# EAGLE design W023A (EAGLE 6.6.0)
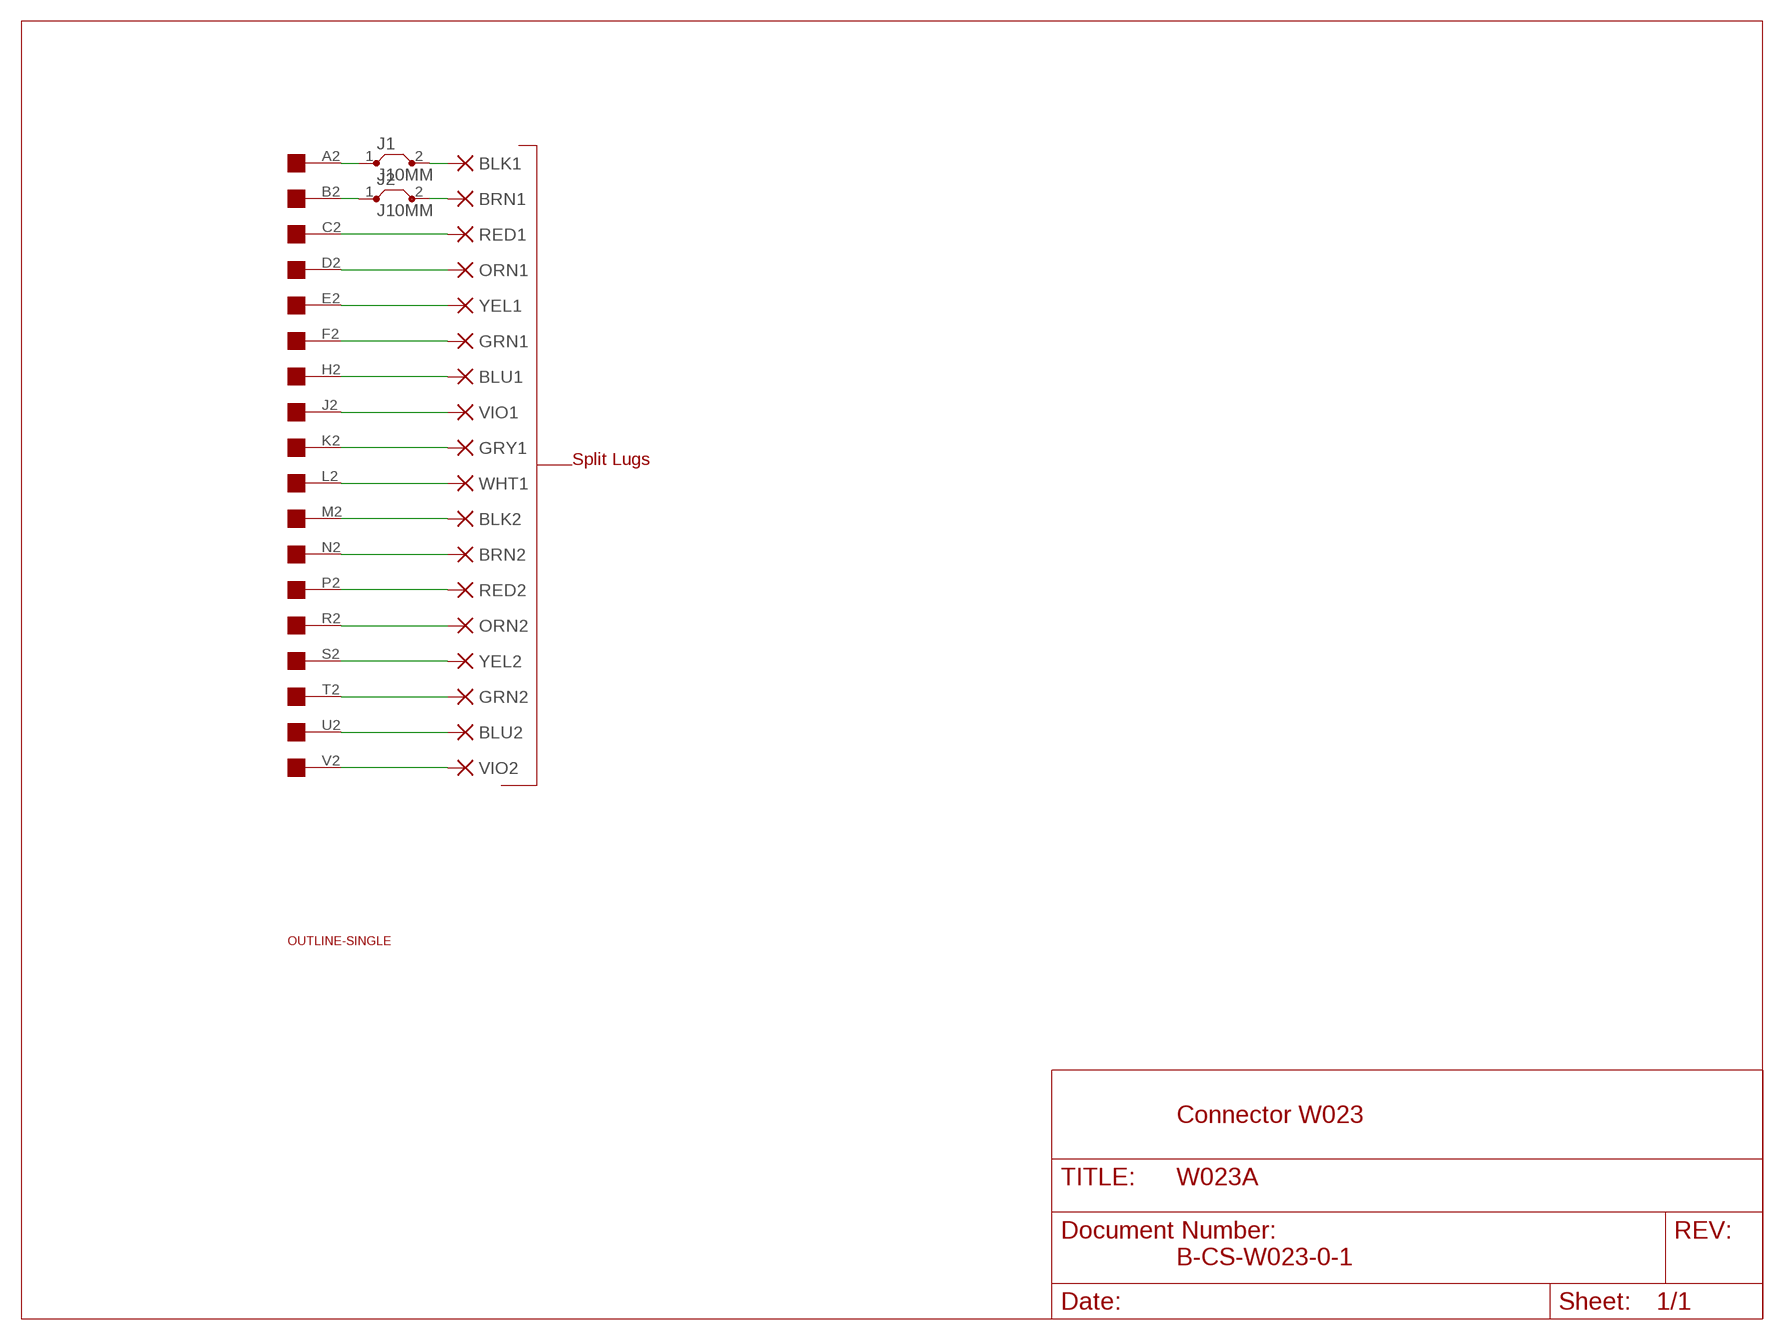
[diagram p0: schematic, sheet 1]

## Parts
BLK1  PAD-0465  [0465]
BLK2  PAD-0465  [0465]
BLU1  PAD-0465  [0465]
BLU2  PAD-0465  [0465]
BRN1  PAD-0465  [0465]
BRN2  PAD-0465  [0465]
GRN1  PAD-0465  [0465]
GRN2  PAD-0465  [0465]
GRY1  PAD-0465  [0465]
J1  J10MM  [10]
J2  J10MM  [10]
ORN1  PAD-0465  [0465]
ORN2  PAD-0465  [0465]
RED1  PAD-0465  [0465]
RED2  PAD-0465  [0465]
U$1  OUTLINE-SINGLE  [SINGLE]
U$2  EDGE-1  [EDGE-CON1]
VIO1  PAD-0465  [0465]
VIO2  PAD-0465  [0465]
WHT1  PAD-0465  [0465]
YEL1  PAD-0465  [0465]
YEL2  PAD-0465  [0465]

## Nets
N$1 [Supply]: RED1.P$1(P) U$2.C2
N$2 [Supply]: GRN1.P$1(P) U$2.F2
N$3 [Supply]: U$2.J2 VIO1.P$1(P)
N$4 [Supply]: U$2.L2 WHT1.P$1(P)
N$5 [Supply]: BRN2.P$1(P) U$2.N2
N$6 [Supply]: ORN2.P$1(P) U$2.R2
N$7 [Supply]: GRN2.P$1(P) U$2.T2
N$8 [Supply]: U$2.V2 VIO2.P$1(P)
N$9: BRN1.P$1(P) J2.2
N$10 [Supply]: BLK1.P$1(P) J1.2
N$12 [Supply]: U$2.E2 YEL1.P$1(P)
N$13 [Supply]: BLU1.P$1(P) U$2.H2
N$14 [Supply]: GRY1.P$1(P) U$2.K2
N$15: ORN1.P$1(P) U$2.D2
N$16 [Supply]: BLU2.P$1(P) U$2.U2
N$17 [Supply]: U$2.S2 YEL2.P$1(P)
N$18 [Supply]: RED2.P$1(P) U$2.P2
N$19 [Supply]: BLK2.P$1(P) U$2.M2
N$20: J2.1 U$2.B2
N$21 [Supply]: J1.1 U$2.A2

## Notes on the sheet
- Split Lugs
- Connector W023
- B-CS-W023-0-1

## Library data of the parts
BLK1 BLK2 BLU1 BLU2 BRN1 BRN2 GRN1 GRN2 GRY1 ORN1 ORN2 RED1 RED2 VIO1 VIO2 WHT1 YEL1 YEL2 = dec-con:PAD: WIRE PAD Standard US Drill Sizes
J1 J2 = jumper:J: Bridge
U$1 = dec-con:OUTLINE-*: Board outlines for DEC boards.
U$2 = dec-con:EDGE-1: Single-Sided DEC Edge Connector -- (side 2)

## Net classes
1 Supply: width 0.813 mm

## Board
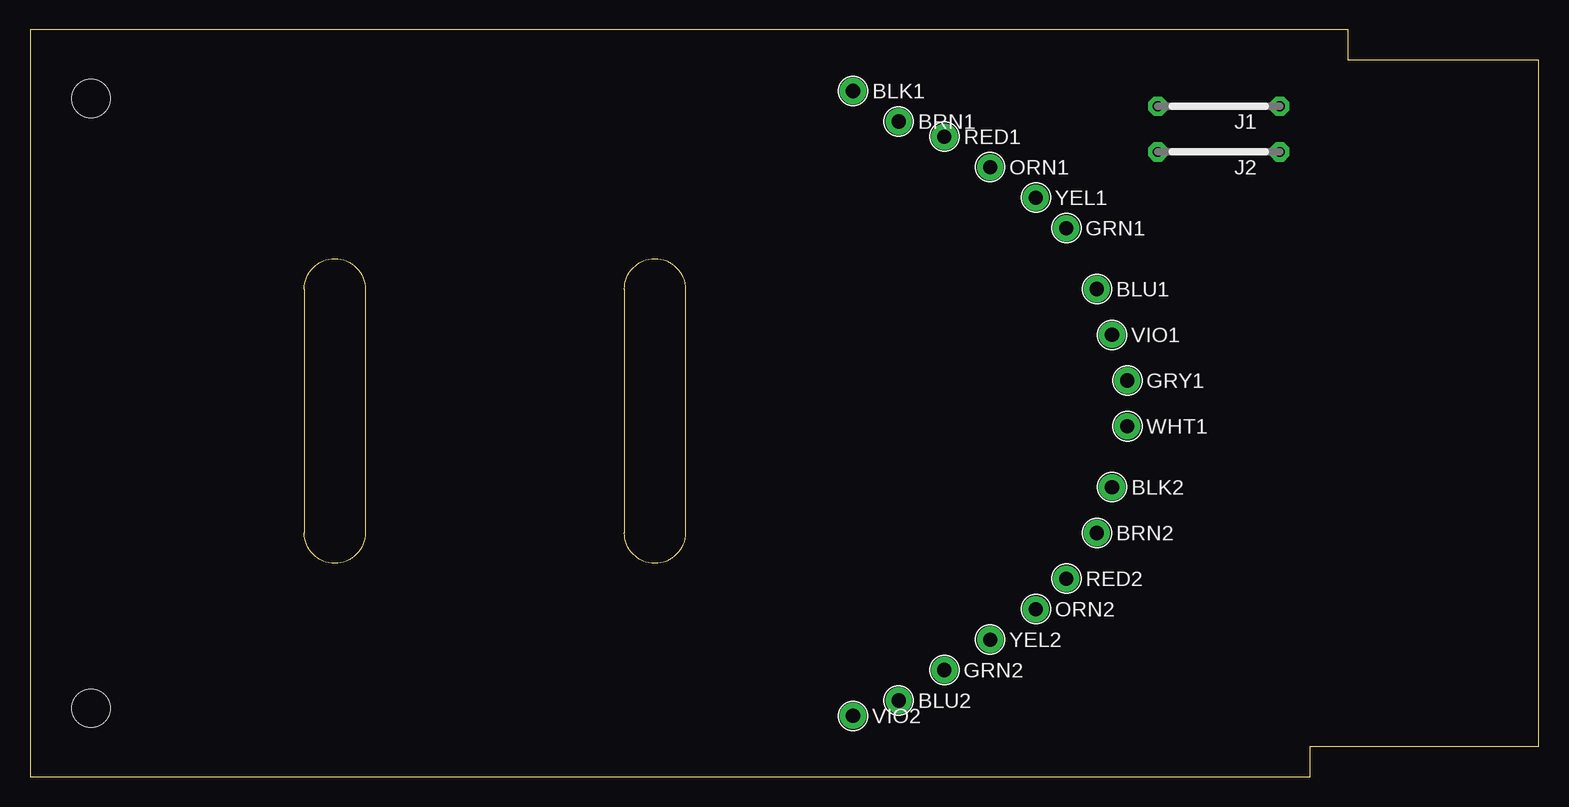
[diagram p1: board, top side]
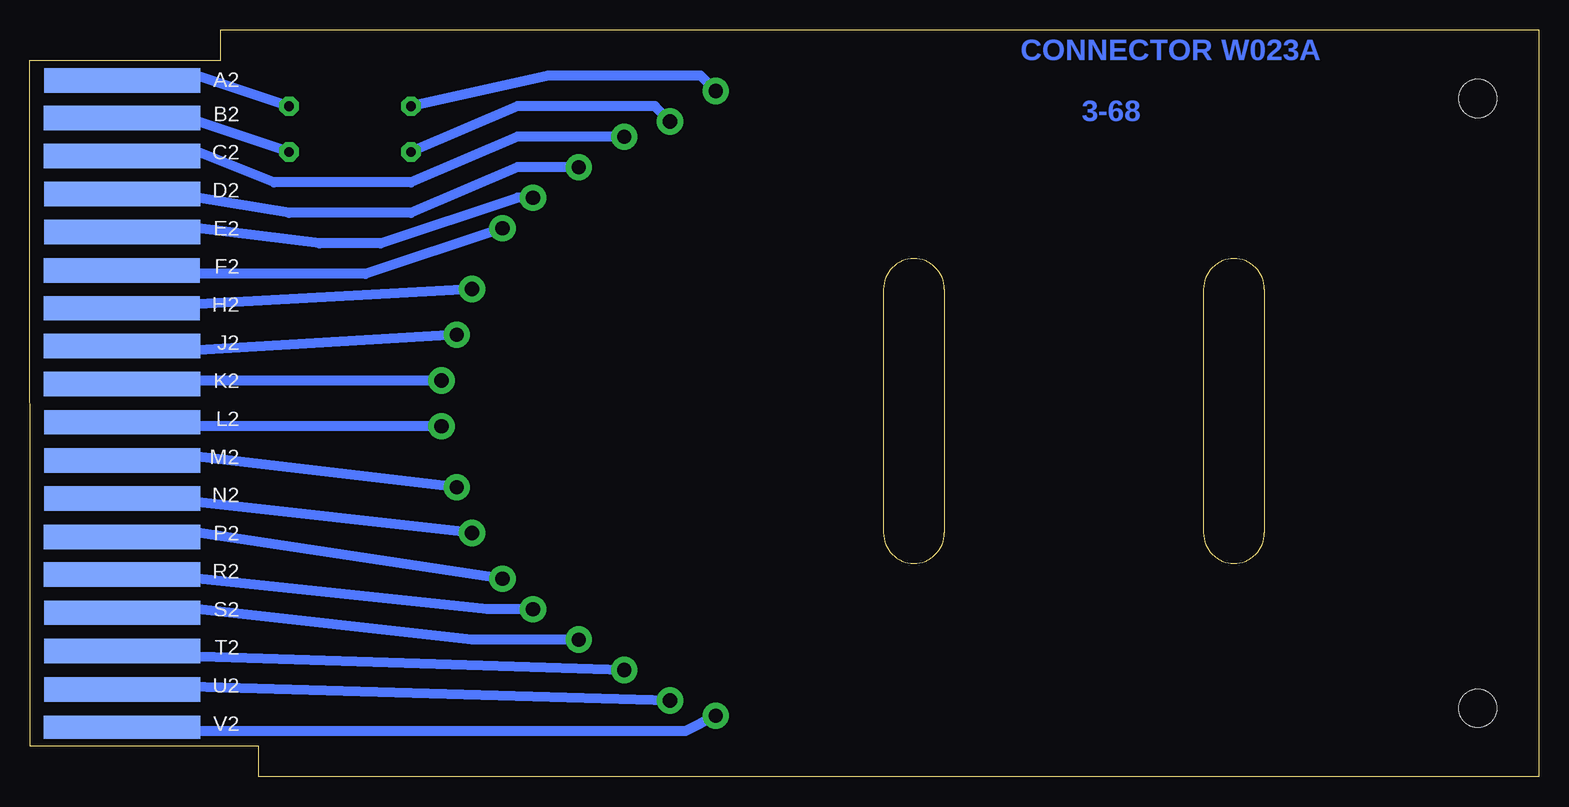
[diagram p2: board, bottom side, seen from below]

Size 125.73 x 62.23 mm. Coordinates in mm from the lower left corner, seen from the top.
Outline: 22.86,40.64 arc-180 27.94,40.64 27.94,20.32 arc-180 22.86,20.32 22.86,40.64
Outline: 49.53,40.64 arc-180 54.61,40.64 54.61,20.32 arc-180 49.53,20.32 49.53,40.64
Copper layers (1+16): Top 0.035mm / dielectric 1.5mm / Bottom 0.035mm
Design rules "16mils": minimum track width 16mil, minimum drill 32mil, track to track 15mil, track to pad 10mil, pad to pad 10mil, via to via 10mil, smd to smd 10mil, copper to edge 25mil, drill to drill 10mil, minimum pad ring 10mil, minimum via ring 8mil, stop-mask expansion 0mil, vias tented up to drill 0mil, thermal gap 10mil

### Footprints (pad centres in the part's own frame; a part is rotated, then mirrored left to right if it is on the bottom)
0465 = drill 1.181 pad 2.184 round: P$1 0,0
10 = drill 0.813 pad 1.6 octagon: 1 -5.08,0; 2 5.08,0
SINGLE = hole 3.175: 120.65,56.515; 120.65,5.715
EDGE-CON1 = smd 13.017 x 2.032 bottom: A2 7.69,4.194; B2 7.668,7.328; C2 7.668,10.49; D2 7.693,13.665; E2 7.693,16.84; F2 7.642,20.041; H2 7.642,23.19; J2 7.668,26.34; K2 7.668,29.515; L2 7.693,32.69; M2 7.693,35.89; N2 7.693,39.04; P2 7.668,42.24; R2 7.668,45.39; S2 7.693,48.565; T2 7.693,51.74; U2 7.693,54.966 | smd 13.017 x 1.905 bottom: V2 7.668,58.102

### Placement (x,y rotation side)
BLK1  68.58,57.15 0 top
BLK2  90.17,24.13 0 top
BLU1  88.9,40.64 0 top
BLU2  72.39,6.35 0 top
BRN1  72.39,54.61 0 top
BRN2  88.9,20.32 0 top
GRN1  86.36,45.72 0 top
GRN2  76.2,8.89 0 top
GRY1  91.44,33.02 0 top
J1  99.06,55.88 180 top
J2  99.06,52.07 180 top
ORN1  80.01,50.8 0 top
ORN2  83.82,13.97 0 top
RED1  76.2,53.34 0 top
RED2  86.36,16.51 0 top
U$1  125.73,62.23 180 top
U$2  125.73,62.23 180 top
VIO1  90.17,36.83 0 top
VIO2  68.58,5.08 0 top
WHT1  91.44,29.21 0 top
YEL1  83.82,48.26 0 top
YEL2  80.01,11.43 0 top

### Tracks (layer width: path | path; a pad name or v marks a point on that pad's centre or on a via)
N$1
  Bottom 0.813: U$2.C2 116.84,52.07 111.76,52.07 105.41,49.53 93.98,49.53 85.09,53.34 83.82,53.34 RED1.P$1
N$2
  Bottom 0.813: GRN1.P$1 97.79,41.91 116.84,41.91 U$2.F2
N$3
  Bottom 0.813: VIO1.P$1 111.76,35.56 116.84,35.56 U$2.J2
N$4
  Bottom 0.813: WHT1.P$1 116.84,29.21 U$2.L2
N$5
  Bottom 0.813: BRN2.P$1 111.76,22.86 116.84,22.86 U$2.N2
N$6
  Bottom 0.813: ORN2.P$1 87.63,13.97 111.76,16.51 116.84,16.51 U$2.R2
N$7
  Bottom 0.813: GRN2.P$1 116.84,10.16 U$2.T2
N$8
  Bottom 0.813: VIO2.P$1 71.12,3.81 116.84,3.81 U$2.V2
N$9
  Bottom 0.813: BRN1.P$1 73.66,55.88 85.09,55.88 J2.2
N$10
  Bottom 0.813: BLK1.P$1 69.85,58.42 82.55,58.42 J1.2
N$12
  Bottom 0.813: YEL1.P$1 85.09,48.26 96.52,44.45 101.6,44.45 111.76,45.72 116.84,45.72 U$2.E2
N$13
  Bottom 0.813: BLU1.P$1 111.76,39.37 116.84,39.37 U$2.H2
N$14
  Bottom 0.813: GRY1.P$1 116.84,33.02 U$2.K2
N$15
  Bottom 0.813: U$2.D2 116.84,48.26 111.76,48.26 104.14,46.99 93.98,46.99 85.09,50.8 ORN1.P$1
N$16
  Bottom 0.813: BLU2.P$1 116.84,7.62 U$2.U2
N$17
  Bottom 0.813: U$2.S2 116.84,13.97 111.76,13.97 88.9,11.43 YEL2.P$1
N$18
  Bottom 0.813: RED2.P$1 111.76,20.32 116.84,20.32 U$2.P2
N$19
  Bottom 0.813: BLK2.P$1 111.76,26.67 116.84,26.67 U$2.M2
N$20
  Bottom 0.813: U$2.B2 116.84,54.61 111.76,54.61 J2.1
N$21
  Bottom 0.813: U$2.A2 116.84,58.42 111.76,58.42 J1.1

### Text on the board
Bottom: CONNECTOR W023A | 3-68